# EAGLE design midi2neopixel (EAGLE 9.6.2)
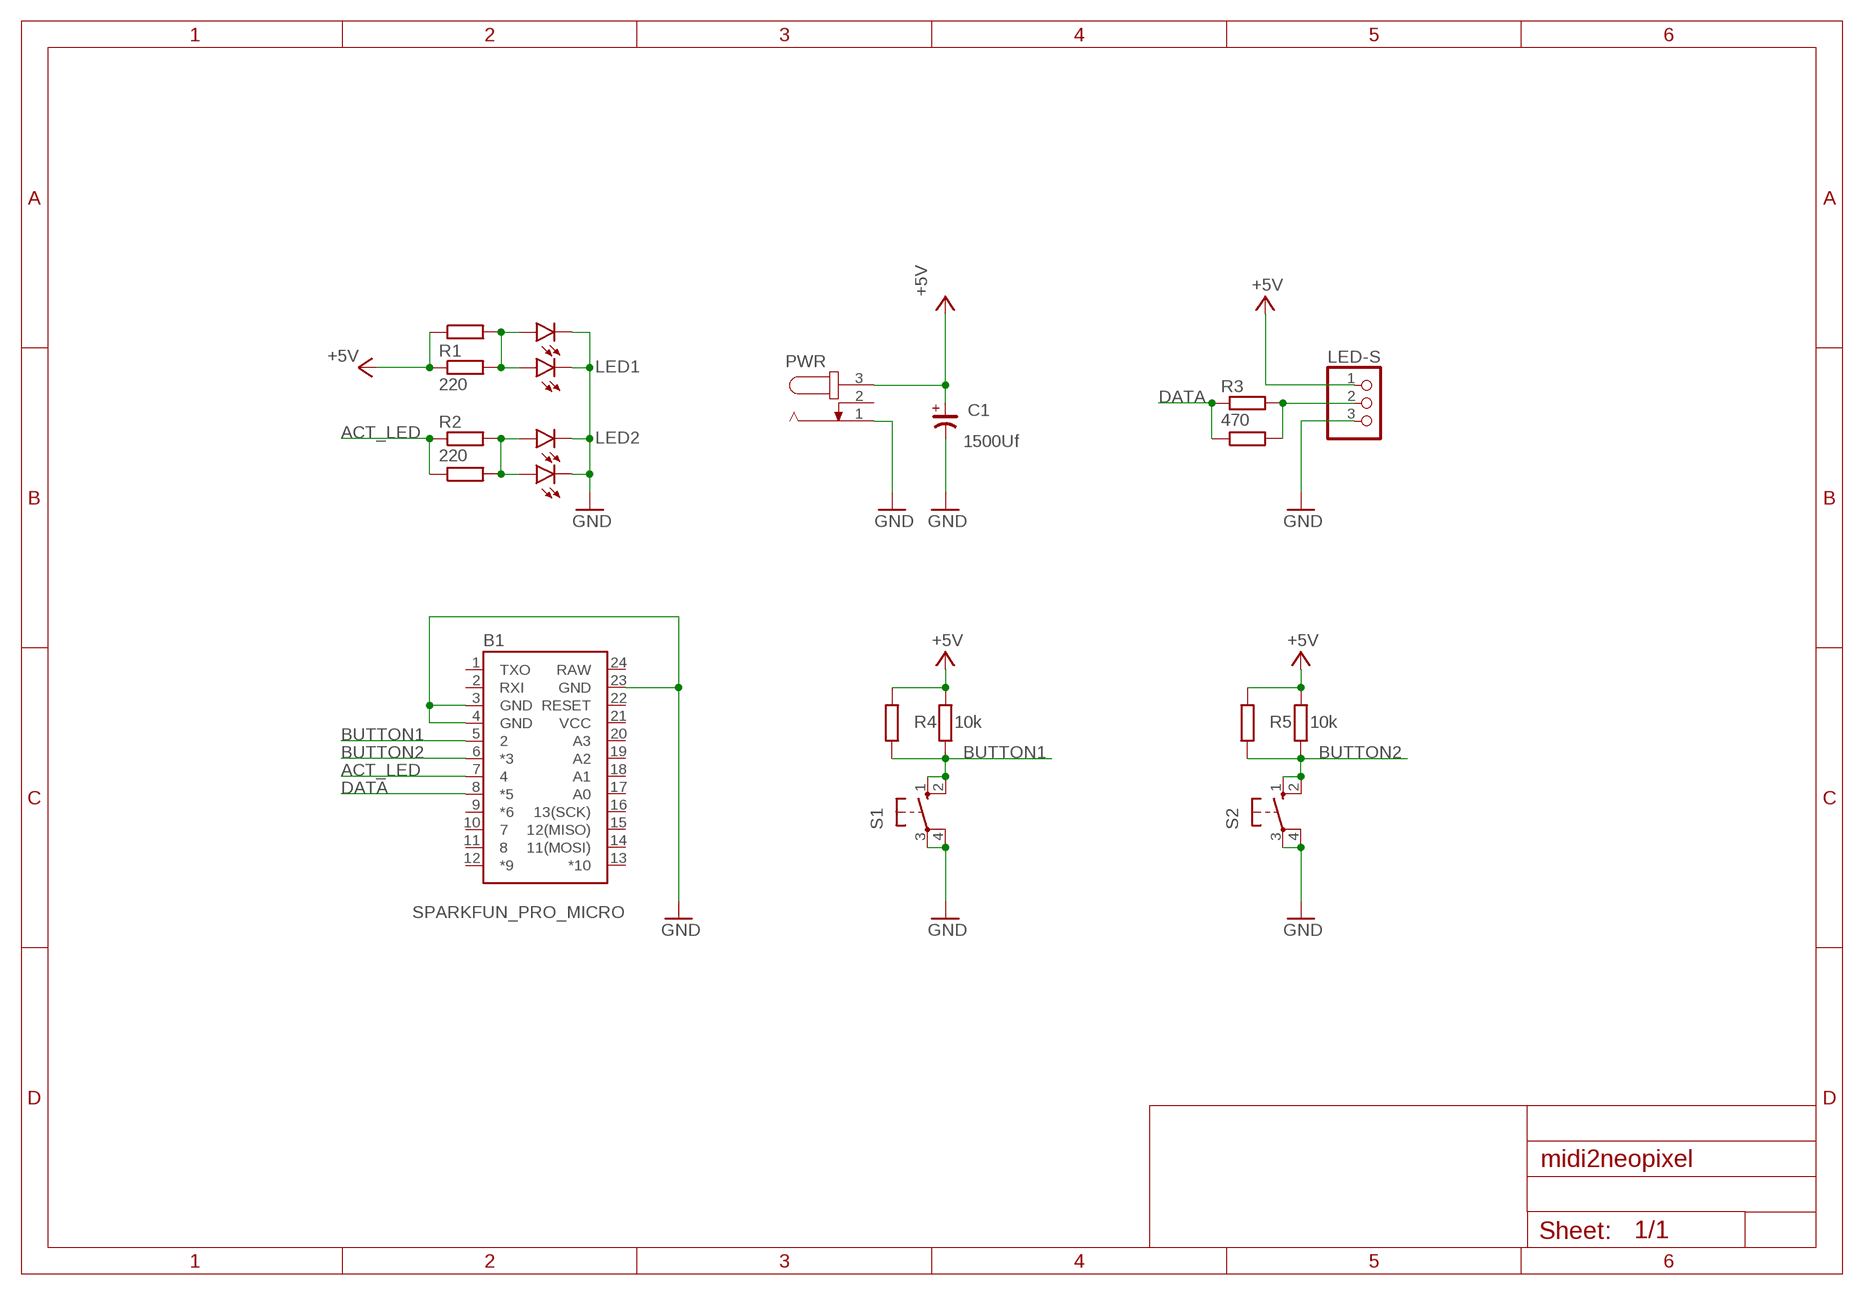
[diagram p0: schematic, sheet 1]

## Parts
B1  SPARKFUN_PRO_MICRO  [SPARKFUN_PRO_MICRO]
C1  1500Uf  CP_EH-050-100X200  [CEH-050-100X200]
LED1  Green  LED3MM  [LED3MM]
LED2  Red  LED3MM  [LED3MM]
LED-S  PINHD-1X3  [1X03]
LEDX1  LEDSML0603  [SML0603]
LEDX2  LEDSML0603  [SML0603]
PWR  JACK-PLUG0  [SPC4077]
R1  220  R-EU_0207/7  [0207/7]
R2  220  R-EU_0207/7  [0207/7]
R3  470  R-EU_0207/7  [0207/7]
R4  10k  R-EU_0207/7  [0207/7]
R5  10k  R-EU_0207/7  [0207/7]
RR1  220  R-EU_R0603  [R0603]
RR2  220  R-EU_R0603  [R0603]
RR3  470  R-EU_R0603  [R0603]
RR4  10k  R-EU_R0603  [R0603]
RR5  10k  R-EU_R0603  [R0603]
S1  10-XX  [B3F-10XX]
S2  10-XX  [B3F-10XX]

## Nets
+5V [power]: C1.+ LED-S.1 PWR.3 R1.1 R4.2 R5.2 RR1.1 RR4.2 RR5.2
ACT_LED: B1.7 R2.1 RR2.1
BUTTON1: B1.5 R4.1 RR4.1 S1.1(S) S1.2(S1)
BUTTON2: B1.6(*3) R5.1 RR5.1 S2.1(S) S2.2(S1)
DATA: B1.8(*5) R3.1 RR3.1
GND [power]: B1.3(GND) B1.4(GND) B1.23(GND) C1.- LED1.K(C) LED2.K(C) LED-S.3 LEDX1.C LEDX2.C PWR.1 S1.3(P) S1.4(P1) S2.3(P) S2.4(P1)
N$1: LED-S.2 R3.2 RR3.2
N$2: LED1.A LEDX1.A R1.2 RR1.2
N$3: LED2.A LEDX2.A R2.2 RR2.2
Unconnected: B1.1(TXO) B1.2(RXI) B1.9(*6) B1.10 B1.11 B1.12(*9) B1.13(*10) B1.14(11(MOSI)) B1.15(12(MISO)) B1.16(13(SCK)) B1.17(A0) B1.18(A1) B1.19(A2) B1.20(A3) B1.22(RESET) PWR.2

## Power pins joined to a net without a drawn wire
RAW: B1.24(RAW)
VCC: B1.21(VCC)

## Library data of the parts
B1 = SparkFun-Boards:SPARKFUN_PRO_MICRO: SparkFun Pro Micro Atmega32U4 compatible footprint. SparkFun Products: 3.3V/8MHz <https://www.sparkfun.com/products/12587> 5V/16MHz <https://www.sparkfun.com/products/12640>
C1 = rc-master:CP_: POLARIZED CAP
LED1 LED2 LEDX1 LEDX2 = led:LED: LED OSRAM: - CHIPLED LG R971, LG N971, LY N971, LG Q971, LY Q971, LO R971, LY R971 LH N974, LH R974 LS Q976, LO Q976, LY Q976 LO Q996 - Hyper CHIPLED LW Q18S LB Q993, LB Q99A, LB R99A - SideLED LS A670, LO A670, LY A670, LG A670, LP A670 LB A673, LV A673, LT A673, LW A673 LH A674 LY A675 LS A676, LA A676, LO A676, LY A676, LW A676 LS A679, LY A679, LG A679 - Hyper Micro SIDELED® LS Y876, LA Y876, LO Y876, LY Y876 LT Y87S - SmartLED LW L88C, LW L88S LB L89C, LB L89S, LG L890 LS L89K, LO L89K, LY L89K LS L896, LA L896, LO L896, LY L896 - TOPLED LS T670, LO T670, LY T670, LG T670, LP T670 LSG T670, LSP T670, LSY T670, LOP T670, LYG T670 LG T671, LOG T671, LSG T671 LB T673, LV T673, LT T673, LW T673 LH T674 LS T676, LA T676, LO T676, LY T676, LB T676, LH T676, LSB T676, LW T676 LB T67C, LV T67C, LT T67C, LS T67K, LO T67K, LY T67K, LW E67C LS E67B, LA E67B, LO E67B, LY E67B, LB E67C, LV E67C, LT E67C LW T67C LS T679, LY T679, LG T679 LS T770, LO T770, LY T770, LG T770, LP T770 LB T773, LV T773, LT T773, LW T773 LH T774 LS E675, LA E675, LY E675, LS T675 LS T776, LA T776, LO T776, LY T776, LB T776 LHGB T686 LT T68C, LB T68C - Hyper Mini TOPLED® LB M676 - Mini TOPLED Santana® LG M470 LS M47K, LO M47K, LY M47K Source: http://www.osram.convergy.de LUXEON: - LUMILED® LXK2-PW12-R00, LXK2-PW12-S00, LXK2-PW14-U00, LXK2-PW14-V00 LXK2-PM12-R00, LXK2-PM12-S00, LXK2-PM14-U00 LXK2-PE12-Q00, LXK2-PE12-R00, LXK2-PE12-S00, LXK2-PE14-T00, LXK2-PE14-U00 LXK2-PB12-K00, LXK2-PB12-L00, LXK2-PB12-M00, LXK2-PB14-N00, LXK2-PB14-P00, LXK2-PB14-Q00 LXK2-PR12-L00, LXK2-PR12-M00, LXK2-PR14-Q00, LXK2-PR14-R00 LXK2-PD12-Q00, LXK2-PD12-R00, LXK2-PD12-S00 LXK2-PH12-R00, LXK2-PH12-S00 LXK2-PL12-P00, LXK2-PL12-Q00, LXK2-PL12-R00 Source: www.luxeon.com KINGBRIGHT: KA-3528ASYC Source: www.kingbright.com
LED-S = pinhead:PINHD-1X3: PIN HEADER
PWR = con-jack:JACK-PLUG: DC POWER JACK Power Jack, DC, Right Angle, Through Hole, Rated 5A at 16VDC, PC Terminals Distributor: Farnell (www.Farnell.de) Drawing: 84N1161.pdf / 84N1162.pdf Manufacturer: SPC Technology (www.spctechnology.com) Type: SPC4077 / SPC 4078; OC_FARNELL: unknown; OC_NEWARK: unknown
R1-R5 RR1-RR5 = rcl:R-EU_: RESISTOR, European symbol; SPICEPREFIX: R
S1 S2 = switch-omron:10-XX: OMRON SWITCH; MPN: B3F-1000; OC_FARNELL: 176432; OC_NEWARK: 36M3542

## Net classes
0 default: width 0.406 mm, clearance 0.203 mm
1 power: width 0.406 mm, clearance 0.203 mm

## Board
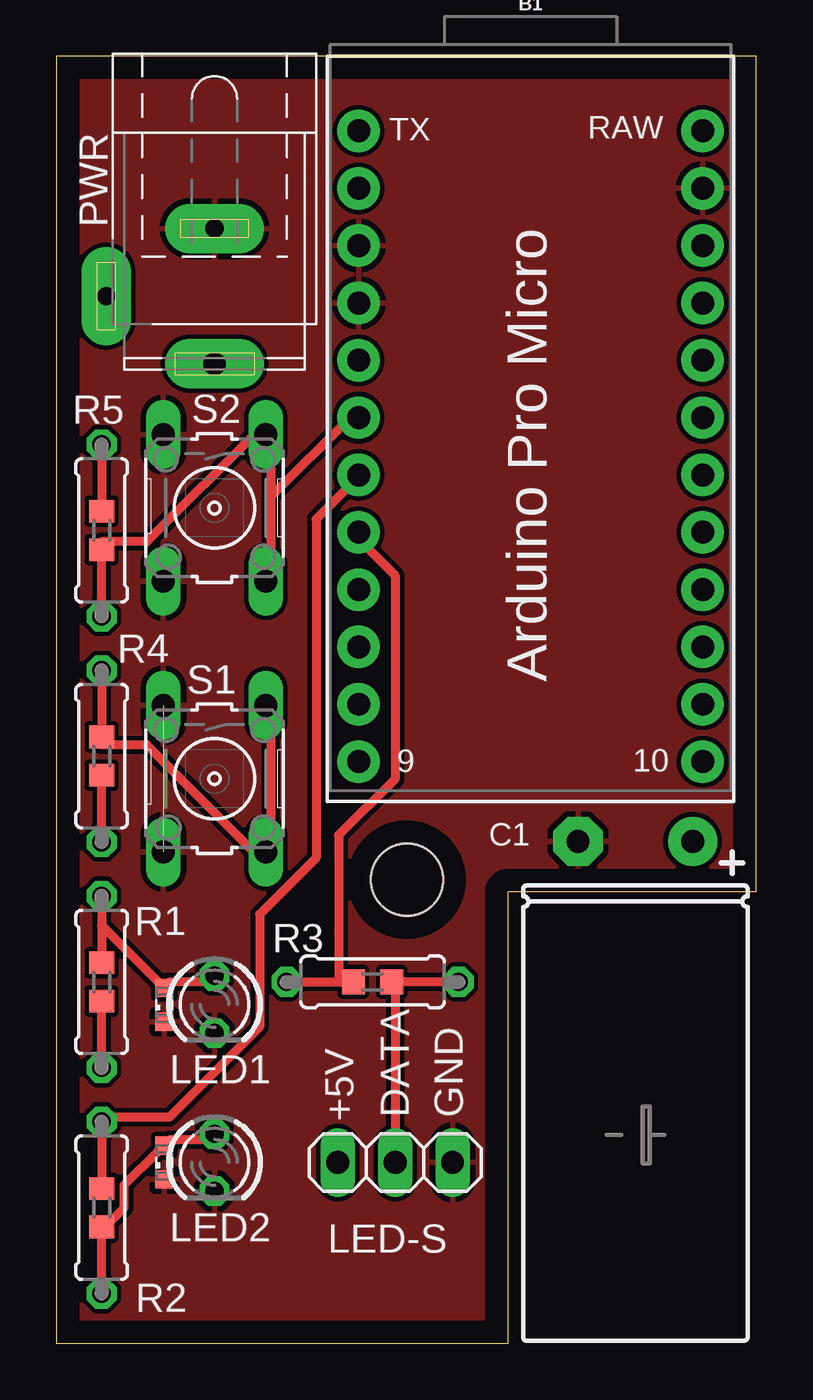
[diagram p1: board, top side]
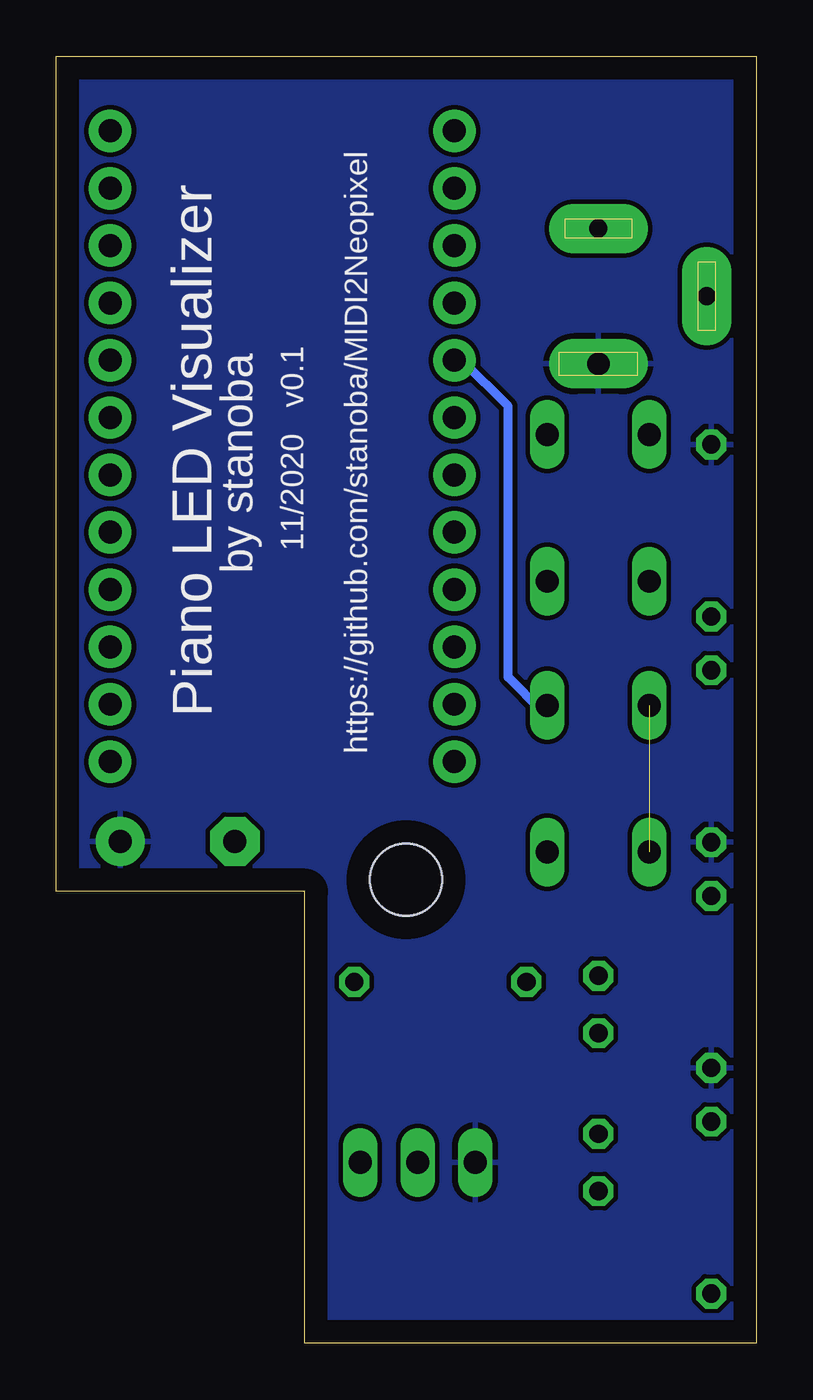
[diagram p2: board, bottom side, seen from below]

Size 31 x 57 mm. Coordinates in mm from the lower left corner, seen from the top.
Outline: 0,0 20,0 20,20 31,20 31,57 0,57 0,0
Copper layers (1*16): Top 0.035mm / dielectric 1.5mm / Bottom 0.035mm
Design rules "default": minimum track width 6mil, minimum drill 0.35mm, track to track 6mil, track to pad 6mil, pad to pad 6mil, via to via 6mil, smd to smd 6mil, copper to edge 40mil, drill to drill 6mil, minimum pad ring 10mil, minimum via ring 8mil, stop-mask expansion 4mil, vias tented up to drill 0mil, thermal gap 10mil
Holes 3.2 mm at 15.52,20.53

### Footprints (pad centres in the part's own frame; a part is rotated, then mirrored left to right if it is on the bottom)
SPARKFUN_PRO_MICRO = drill 1.016 pad 1.88: 1 -7.62,12.7; 2 -7.62,10.16; 3 -7.62,7.62; 4 -7.62,5.08; 5 -7.62,2.54; 6 -7.62,0; 7 -7.62,-2.54; 8 -7.62,-5.08; 9 -7.62,-7.62; 10 -7.62,-10.16; 11 -7.62,-12.7; 12 -7.62,-15.24; 13 7.62,-15.24; 14 7.62,-12.7; 15 7.62,-10.16; 16 7.62,-7.62; 17 7.62,-5.08; 18 7.62,-2.54; 19 7.62,0; 20 7.62,2.54; 21 7.62,5.08; 22 7.62,7.62; 23 7.62,10.16; 24 7.62,12.7
CEH-050-100X200 = drill 1.016 pad 2.184: + -2.54,0 | drill 1.016 pad 2.184 octagon: - 2.54,0
LED3MM = drill 0.813 octagon: A -1.27,0; K 1.27,0
1X03 = drill 1.016 long: 1 -2.54,0; 2 0,0; 3 2.54,0
SML0603 = smd 0.8 x 0.8: A 0.75,0; C -0.75,0
SPC4077 = drill 0.8 pad 2.184 long: 1 -3,0; 2 0,-4.8 | drill 1 pad 2.184 long: 3 3,0
0207/7 = drill 0.813 octagon: 1 -3.81,0; 2 3.81,0
R0603 = smd 1 x 1.1: 1 -0.85,0; 2 0.85,0
B3F-10XX = drill 1.016 long: 1 -3.251,2.261; 2 3.251,2.261; 3 -3.251,-2.261; 4 3.251,-2.261

### Placement (x,y rotation side)
B1  21,41 0 top
C1  25.64,22.23 180 top
LED1  7,15 270 top
LED2  7,8 270 top
LED-S  15,8 0 top
LEDX1  4.78,14.99 90 top
LEDX2  4.77,8 90 top
PWR  7,46.38 270 top
R1  2,16 90 top
R2  2,6 270 top
R3  14,16 0 top
R4  2,26 270 top
R5  2,36 90 top
RR1  2,16 90 top
RR2  2,6 270 top
RR3  14,16 0 top
RR4  2,26 270 top
RR5  2,36 90 top
S1  7,25 270 top
S2  7,37 270 top

### Tracks (layer width: path | path; a pad name or v marks a point on that pad's centre or on a via)
+5V
  Top 0.406: R1.1 RR1.1 | R4.2 RR4.2 | R5.2 RR5.2
  pour Bottom: -2,-1 32,-1 32,59 -2,59
ACT_LED
  Top 0.406: RR2.1 R2.1 2,10 5,10 9,14 9,19 11.5,21.5 11.5,36.5 13,38 B1.7
BUTTON1
  Top 0.406: R4.1 RR4.1 2,26.5 4,26.5 9,21.5 S1.2 9.5,22 9.5,28 S1.1
  Bottom 0.406: B1.5 13,43.5 11,41.5 11,29.5 9.5,28 S1.1
BUTTON2
  Top 0.406: R5.1 RR5.1 2,35.5 4,35.5 9,40.5 S2.1 9.5,40 9.5,37.5 | 9.5,37.5 9.5,34 S2.2 | 9.5,37.5 13,41 B1.6
DATA
  Top 0.406: R3.1 12.5,16 | 12.5,16 RR3.1 | 12.5,16 12.5,22.5 15,25 15,34 13.5,35.5 B1.8
GND  (1 unrouted)
  pour Top: -2,-1 32,-1 32,60 -2,60
N$1
  Top 0.406: R3.2 15,16 | 15,16 LED-S.2 | 15,16 RR3.2
N$2
  Top 0.406: LED1.A 7,16 5,16 LEDX1.A 4.5,16 2,18.5 | R1.2 2,18.5 | 2,18.5 RR1.2
N$3
  Top 0.406: LED2.A 7,9 5,9 LEDX2.A 4.5,8.5 3,7 3,6 2,5 | R2.2 2,5 | 2,5 RR2.2

### Text on the board
tNames: RAW | TX | Arduino Pro Micro | 9 | 10 | +5V | DATA | GND
bNames: v0.1 | 11/2020 | by stanoba | Piano LED Visualizer | https://github.com/stanoba/MIDI2Neopixel